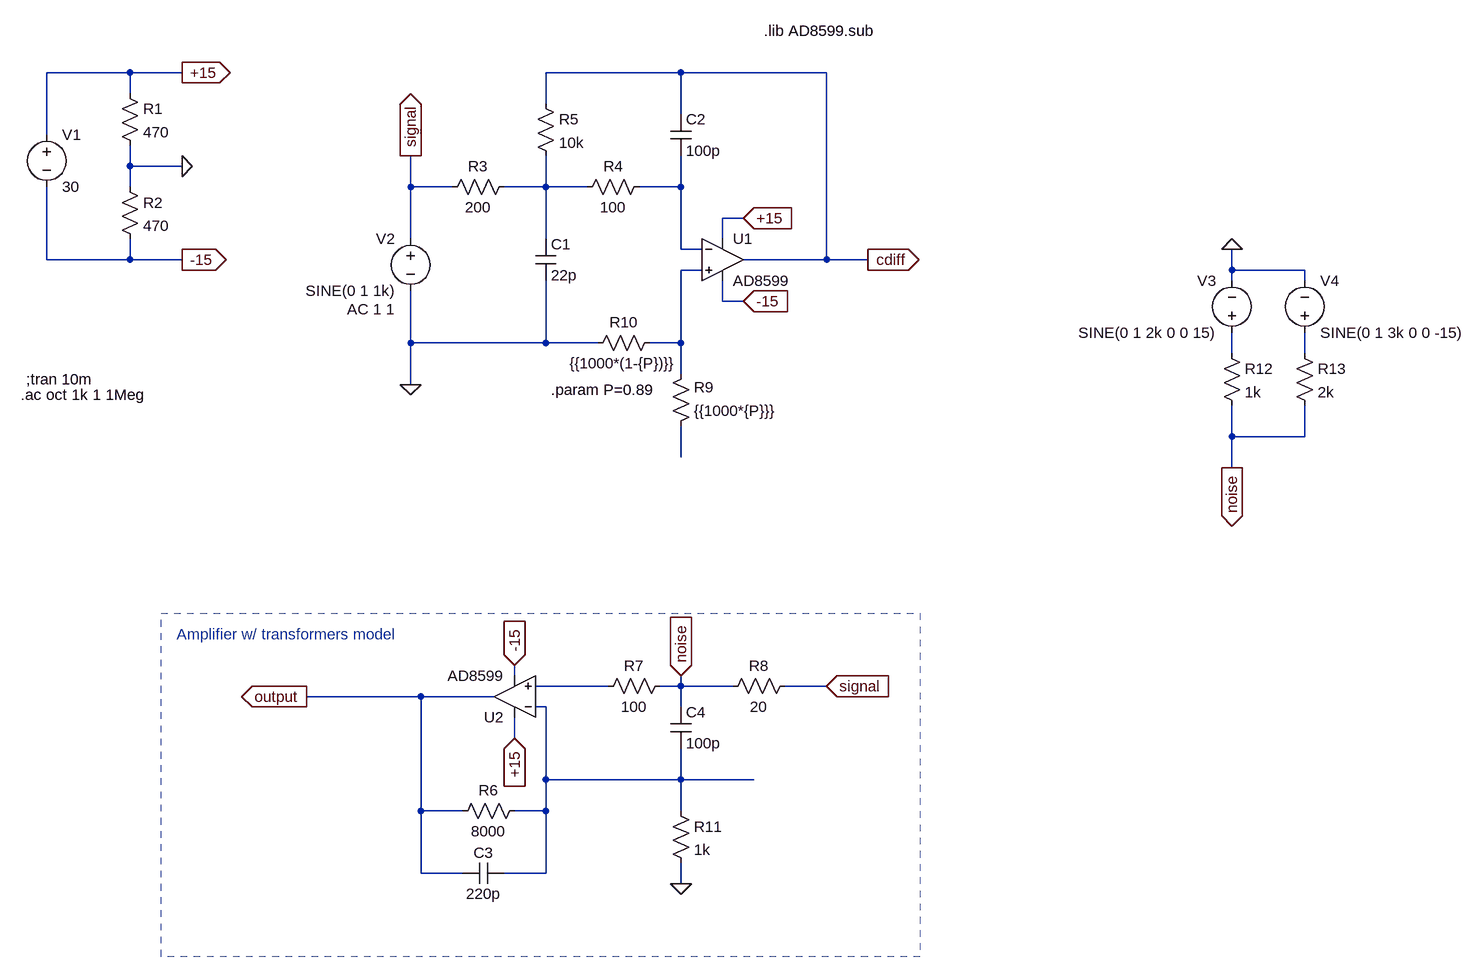
[diagram p0: schematic cdiff.asc]
cdiff.asc, the LTspice schematic file:
Version 4
SHEET 1 3068 2596
WIRE 144 -128 16 -128
WIRE 224 -128 144 -128
WIRE 992 -128 784 -128
WIRE 1216 -128 992 -128
WIRE 144 -96 144 -128
WIRE 784 -80 784 -128
WIRE 992 -64 992 -128
WIRE 16 -32 16 -128
WIRE 144 16 144 -16
WIRE 224 16 144 16
WIRE 144 48 144 16
WIRE 576 48 576 0
WIRE 640 48 576 48
WIRE 784 48 784 0
WIRE 784 48 720 48
WIRE 848 48 784 48
WIRE 992 48 992 0
WIRE 992 48 928 48
WIRE 1088 96 1056 96
WIRE 576 128 576 48
WIRE 784 128 784 48
WIRE 1056 128 1056 96
WIRE 992 144 992 48
WIRE 1024 144 992 144
WIRE 16 160 16 48
WIRE 144 160 144 128
WIRE 144 160 16 160
WIRE 224 160 144 160
WIRE 1216 160 1216 -128
WIRE 1216 160 1088 160
WIRE 1280 160 1216 160
WIRE 1024 176 992 176
WIRE 1840 176 1840 144
WIRE 1952 176 1840 176
WIRE 1840 192 1840 176
WIRE 1952 192 1952 176
WIRE 1056 224 1056 192
WIRE 1088 224 1056 224
WIRE 576 288 576 208
WIRE 784 288 784 192
WIRE 784 288 576 288
WIRE 864 288 784 288
WIRE 992 288 992 176
WIRE 992 288 944 288
WIRE 1840 304 1840 272
WIRE 1952 304 1952 272
WIRE 992 336 992 288
WIRE 576 352 576 288
WIRE 1840 432 1840 384
WIRE 1952 432 1952 384
WIRE 1952 432 1840 432
WIRE 992 464 992 416
WIRE 1840 480 1840 432
WIRE 736 800 736 784
WIRE 880 816 768 816
WIRE 992 816 992 800
WIRE 992 816 960 816
WIRE 1072 816 992 816
WIRE 1216 816 1152 816
WIRE 592 832 416 832
WIRE 704 832 592 832
WIRE 784 848 768 848
WIRE 992 848 992 816
WIRE 736 896 736 864
WIRE 784 960 784 848
WIRE 992 960 992 912
WIRE 992 960 784 960
WIRE 1104 960 992 960
WIRE 592 1008 592 832
WIRE 656 1008 592 1008
WIRE 784 1008 784 960
WIRE 784 1008 736 1008
WIRE 992 1008 992 960
WIRE 592 1104 592 1008
WIRE 656 1104 592 1104
WIRE 784 1104 784 1008
WIRE 784 1104 720 1104
WIRE 992 1120 992 1088
FLAG 224 16 0
FLAG 224 -128 +15
IOPIN 224 -128 Out
FLAG 224 160 -15
IOPIN 224 160 Out
FLAG 1088 96 +15
IOPIN 1088 96 In
FLAG 1088 224 -15
IOPIN 1088 224 In
FLAG 1280 160 cdiff
IOPIN 1280 160 Out
FLAG 576 352 0
FLAG 576 0 signal
IOPIN 576 0 Out
FLAG 992 1120 0
FLAG 1216 816 signal
IOPIN 1216 816 In
FLAG 736 896 +15
IOPIN 736 896 In
FLAG 736 784 -15
IOPIN 736 784 In
FLAG 416 832 output
IOPIN 416 832 Out
FLAG 1840 144 0
FLAG 1840 480 noise
IOPIN 1840 480 Out
FLAG 992 800 noise
IOPIN 992 800 In
SYMBOL voltage 16 -48 R0
WINDOW 123 0 0 Left 2
WINDOW 39 0 0 Left 2
SYMATTR InstName V1
SYMATTR Value 30
SYMBOL res 128 -112 R0
SYMATTR InstName R1
SYMATTR Value 470
SYMBOL res 128 32 R0
SYMATTR InstName R2
SYMATTR Value 470
SYMBOL voltage 576 112 M0
WINDOW 123 24 124 Left 2
WINDOW 39 0 0 Left 2
SYMATTR Value2 AC 1 1
SYMATTR InstName V2
SYMATTR Value SINE(0 1 1k)
SYMBOL res 736 32 R90
WINDOW 0 0 56 VBottom 2
WINDOW 3 32 56 VTop 2
SYMATTR InstName R3
SYMATTR Value 200
SYMBOL cap 768 128 R0
SYMATTR InstName C1
SYMATTR Value 22p
SYMBOL res 768 -96 R0
SYMATTR InstName R5
SYMATTR Value 10k
SYMBOL cap 976 -64 R0
SYMATTR InstName C2
SYMATTR Value 100p
SYMBOL Opamps\\AD8599 1056 96 R0
SYMATTR InstName U1
SYMBOL Opamps\\AD8599 736 896 R180
SYMATTR InstName U2
SYMBOL res 976 800 R90
WINDOW 0 0 56 VBottom 2
WINDOW 3 32 56 VTop 2
SYMATTR InstName R7
SYMATTR Value 100
SYMBOL res 1168 800 R90
WINDOW 0 0 56 VBottom 2
WINDOW 3 32 56 VTop 2
SYMATTR InstName R8
SYMATTR Value 20
SYMBOL res 976 432 M180
WINDOW 0 36 76 Left 2
WINDOW 3 36 40 Left 2
SYMATTR InstName R9
SYMATTR Value {{1000*{P}}}
SYMBOL res 960 272 R90
WINDOW 0 0 56 VBottom 2
WINDOW 3 32 56 VTop 2
SYMATTR InstName R10
SYMATTR Value {{1000*(1-{P})}}
SYMBOL res 752 992 R90
WINDOW 0 0 56 VBottom 2
WINDOW 3 32 56 VTop 2
SYMATTR InstName R6
SYMATTR Value 8000
SYMBOL cap 720 1088 R90
WINDOW 0 0 32 VBottom 2
WINDOW 3 32 32 VTop 2
SYMATTR InstName C3
SYMATTR Value 220p
SYMBOL cap 976 848 R0
SYMATTR InstName C4
SYMATTR Value 100p
SYMBOL res 976 992 R0
SYMATTR InstName R11
SYMATTR Value 1k
SYMBOL voltage 1840 288 R180
WINDOW 0 24 96 Left 2
WINDOW 3 24 16 Left 2
WINDOW 123 0 0 Left 2
WINDOW 39 0 0 Left 2
SYMATTR InstName V3
SYMATTR Value SINE(0 1 2k 0 0 15)
SYMBOL res 1824 288 R0
SYMATTR InstName R12
SYMATTR Value 1k
SYMBOL voltage 1952 288 M180
WINDOW 0 24 96 Left 2
WINDOW 3 24 16 Left 2
WINDOW 123 0 0 Left 2
WINDOW 39 0 0 Left 2
SYMATTR InstName V4
SYMATTR Value SINE(0 1 3k 0 0 -15)
SYMBOL res 1936 288 R0
SYMATTR InstName R13
SYMATTR Value 2k
SYMBOL res 944 32 R90
WINDOW 0 0 56 VBottom 2
WINDOW 3 32 56 VTop 2
SYMATTR InstName R4
SYMATTR Value 100
TEXT -16 344 Left 2 !;tran 10m
TEXT -24 368 Left 2 !.ac oct 1k 1 1Meg
TEXT 1120 -192 Left 2 !.lib AD8599.sub
TEXT 216 736 Left 2 ;Amplifier w/ transformers model
TEXT 792 360 Left 2 !.param P=0.89
RECTANGLE Normal 1360 1232 192 704 2

The netlist it stands for:
* cdiff.asc
V1 +15 -15 30
R1 +15 0 470
R2 0 -15 470
V2 signal 0 SINE(0 1 1k) AC 1 1
R3 N001 signal 200
C1 N001 0 22p
R5 cdiff N001 10k
C2 cdiff N002 100p
XU1 N003 N002 +15 -15 cdiff AD8599  ; pins In+ In- V+ V- OUT
XU2 N007 N008 +15 -15 output AD8599  ; pins In+ In- V+ V- OUT
R7 noise N007 100
R8 signal noise 20
R9 N006 N003 {{1000*{P}}}
R10 N003 0 {{1000*(1-{P})}}
R6 N008 output 8000
C3 N008 output 220p
C4 noise N008 100p
R11 N008 0 1k
V3 N004 0 SINE(0 1 2k 0 0 15)
R12 N004 noise 1k
V4 N005 0 SINE(0 1 3k 0 0 -15)
R13 N005 noise 2k
R4 N002 N001 100
;tran 10m
.ac oct 1k 1 1Meg
.lib AD8599.sub
* Amplifier w/ transformers model
.param P=0.89
.backanno
.end